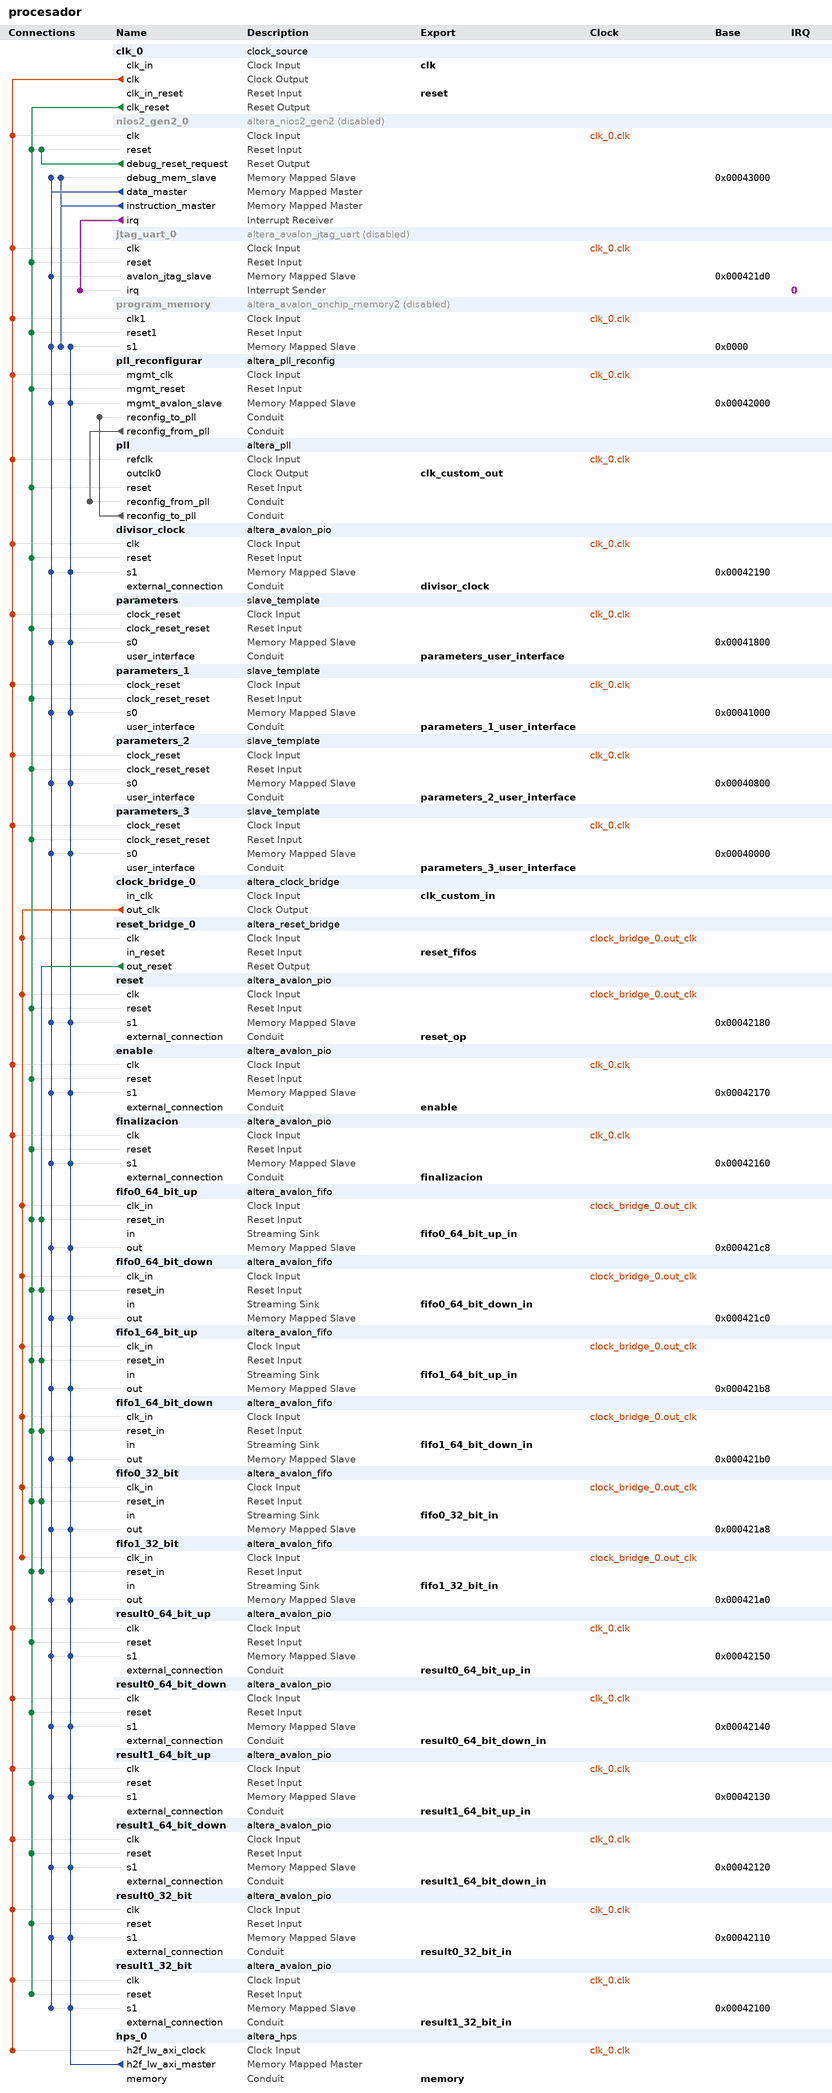
[diagram p0: system contents]
# Platform Designer (Qsys) system procesador, Cyclone V 5CSEMA5F31C6
# Parameters at their usual value, and those the tool derives, are not listed.
package require -exact qsys 17.1
create_system procesador
set_project_property DEVICE_FAMILY {Cyclone V}
set_project_property DEVICE 5CSEMA5F31C6

add_instance clk_0 clock_source 17.1
set_instance_parameter_value clk_0 clockFrequency 50000000

add_instance nios2_gen2_0 altera_nios2_gen2 17.1
set_instance_property nios2_gen2_0 ENABLED false
set_instance_parameter_value nios2_gen2_0 dcache_size 2048
set_instance_parameter_value nios2_gen2_0 exceptionSlave program_memory.s1
set_instance_parameter_value nios2_gen2_0 icache_size 4096
set_instance_parameter_value nios2_gen2_0 impl Tiny
set_instance_parameter_value nios2_gen2_0 resetSlave program_memory.s1

add_instance jtag_uart_0 altera_avalon_jtag_uart 17.1
set_instance_property jtag_uart_0 ENABLED false
set_instance_parameter_value jtag_uart_0 simInteractiveOptions NO_INTERACTIVE_WINDOWS

add_instance program_memory altera_avalon_onchip_memory2 17.1
set_instance_property program_memory ENABLED false
set_instance_parameter_value program_memory dataWidth 32
set_instance_parameter_value program_memory dualPort false
set_instance_parameter_value program_memory initMemContent true
set_instance_parameter_value program_memory initializationFileName onchip_mem.hex
set_instance_parameter_value program_memory memorySize 150000

add_instance pll_reconfigurar altera_pll_reconfig 17.1

add_instance pll altera_pll 17.1
set_instance_parameter_value pll gui_device_speed_grade 2
set_instance_parameter_value pll gui_en_adv_params true
set_instance_parameter_value pll gui_en_reconf true
set_instance_parameter_value pll gui_number_of_clocks 1
set_instance_parameter_value pll gui_operation_mode direct
set_instance_parameter_value pll gui_output_clock_frequency0 65.0
set_instance_parameter_value pll gui_pll_mode {Integer-N PLL}
set_instance_parameter_value pll gui_reference_clock_frequency 50.0
set_instance_parameter_value pll gui_use_locked false

add_instance divisor_clock altera_avalon_pio 17.1
set_instance_parameter_value divisor_clock direction Output
set_instance_parameter_value divisor_clock width 32

add_instance parameters slave_template 2.0
set_instance_parameter_value parameters DATA_WIDTH 32
set_instance_parameter_value parameters ENABLE_SYNC_SIGNALS 0
set_instance_parameter_value parameters IRQ_EN 0
set_instance_parameter_value parameters MODE_0 0
set_instance_parameter_value parameters MODE_1 0
set_instance_parameter_value parameters MODE_10 1
set_instance_parameter_value parameters MODE_11 1
set_instance_parameter_value parameters MODE_12 1
set_instance_parameter_value parameters MODE_13 1
set_instance_parameter_value parameters MODE_14 1
set_instance_parameter_value parameters MODE_15 1
set_instance_parameter_value parameters MODE_2 0
set_instance_parameter_value parameters MODE_3 0
set_instance_parameter_value parameters MODE_4 0
set_instance_parameter_value parameters MODE_5 0
set_instance_parameter_value parameters MODE_6 0
set_instance_parameter_value parameters MODE_7 0
set_instance_parameter_value parameters MODE_8 0
set_instance_parameter_value parameters MODE_9 0

add_instance parameters_1 slave_template 2.0
set_instance_parameter_value parameters_1 DATA_WIDTH 32
set_instance_parameter_value parameters_1 ENABLE_SYNC_SIGNALS 0
set_instance_parameter_value parameters_1 IRQ_EN 0
set_instance_parameter_value parameters_1 MODE_0 0
set_instance_parameter_value parameters_1 MODE_1 0
set_instance_parameter_value parameters_1 MODE_10 1
set_instance_parameter_value parameters_1 MODE_11 1
set_instance_parameter_value parameters_1 MODE_12 1
set_instance_parameter_value parameters_1 MODE_13 1
set_instance_parameter_value parameters_1 MODE_14 1
set_instance_parameter_value parameters_1 MODE_15 1
set_instance_parameter_value parameters_1 MODE_2 0
set_instance_parameter_value parameters_1 MODE_3 0
set_instance_parameter_value parameters_1 MODE_4 0
set_instance_parameter_value parameters_1 MODE_5 0
set_instance_parameter_value parameters_1 MODE_6 0
set_instance_parameter_value parameters_1 MODE_7 0
set_instance_parameter_value parameters_1 MODE_8 0
set_instance_parameter_value parameters_1 MODE_9 0

add_instance parameters_2 slave_template 2.0
set_instance_parameter_value parameters_2 DATA_WIDTH 32
set_instance_parameter_value parameters_2 ENABLE_SYNC_SIGNALS 0
set_instance_parameter_value parameters_2 IRQ_EN 0
set_instance_parameter_value parameters_2 MODE_0 0
set_instance_parameter_value parameters_2 MODE_1 0
set_instance_parameter_value parameters_2 MODE_10 1
set_instance_parameter_value parameters_2 MODE_11 1
set_instance_parameter_value parameters_2 MODE_12 1
set_instance_parameter_value parameters_2 MODE_13 1
set_instance_parameter_value parameters_2 MODE_14 1
set_instance_parameter_value parameters_2 MODE_15 1
set_instance_parameter_value parameters_2 MODE_2 0
set_instance_parameter_value parameters_2 MODE_3 0
set_instance_parameter_value parameters_2 MODE_4 0
set_instance_parameter_value parameters_2 MODE_5 0
set_instance_parameter_value parameters_2 MODE_6 0
set_instance_parameter_value parameters_2 MODE_7 0
set_instance_parameter_value parameters_2 MODE_8 0
set_instance_parameter_value parameters_2 MODE_9 0

add_instance parameters_3 slave_template 2.0
set_instance_parameter_value parameters_3 DATA_WIDTH 32
set_instance_parameter_value parameters_3 ENABLE_SYNC_SIGNALS 0
set_instance_parameter_value parameters_3 IRQ_EN 0
set_instance_parameter_value parameters_3 MODE_0 0
set_instance_parameter_value parameters_3 MODE_1 0
set_instance_parameter_value parameters_3 MODE_10 1
set_instance_parameter_value parameters_3 MODE_11 1
set_instance_parameter_value parameters_3 MODE_12 1
set_instance_parameter_value parameters_3 MODE_13 1
set_instance_parameter_value parameters_3 MODE_14 1
set_instance_parameter_value parameters_3 MODE_15 1
set_instance_parameter_value parameters_3 MODE_2 0
set_instance_parameter_value parameters_3 MODE_3 0
set_instance_parameter_value parameters_3 MODE_4 0
set_instance_parameter_value parameters_3 MODE_5 0
set_instance_parameter_value parameters_3 MODE_6 0
set_instance_parameter_value parameters_3 MODE_7 0
set_instance_parameter_value parameters_3 MODE_8 0
set_instance_parameter_value parameters_3 MODE_9 0

add_instance clock_bridge_0 altera_clock_bridge 17.1
set_instance_parameter_value clock_bridge_0 DERIVED_CLOCK_RATE 0
set_instance_parameter_value clock_bridge_0 EXPLICIT_CLOCK_RATE 0

add_instance reset_bridge_0 altera_reset_bridge 17.1
set_instance_parameter_value reset_bridge_0 ACTIVE_LOW_RESET 0
set_instance_parameter_value reset_bridge_0 SYNCHRONOUS_EDGES deassert

add_instance reset altera_avalon_pio 17.1
set_instance_parameter_value reset direction Output
set_instance_parameter_value reset width 1

add_instance enable altera_avalon_pio 17.1
set_instance_parameter_value enable direction Output
set_instance_parameter_value enable width 1

add_instance finalizacion altera_avalon_pio 17.1
set_instance_parameter_value finalizacion direction Input
set_instance_parameter_value finalizacion width 1

add_instance fifo0_64_bit_up altera_avalon_fifo 17.1
set_instance_parameter_value fifo0_64_bit_up bitsPerSymbol 32
set_instance_parameter_value fifo0_64_bit_up channelWidth 0
set_instance_parameter_value fifo0_64_bit_up errorWidth 0
set_instance_parameter_value fifo0_64_bit_up fifoDepth 16
set_instance_parameter_value fifo0_64_bit_up fifoInputInterfaceOptions AVALONST_SINK
set_instance_parameter_value fifo0_64_bit_up fifoOutputInterfaceOptions AVALONMM_READ
set_instance_parameter_value fifo0_64_bit_up singleClockMode true
set_instance_parameter_value fifo0_64_bit_up symbolsPerBeat 1
set_instance_parameter_value fifo0_64_bit_up useIRQ true
set_instance_parameter_value fifo0_64_bit_up usePacket false
set_instance_parameter_value fifo0_64_bit_up useReadControl false
set_instance_parameter_value fifo0_64_bit_up useWriteControl false

add_instance fifo0_64_bit_down altera_avalon_fifo 17.1
set_instance_parameter_value fifo0_64_bit_down bitsPerSymbol 32
set_instance_parameter_value fifo0_64_bit_down channelWidth 0
set_instance_parameter_value fifo0_64_bit_down errorWidth 0
set_instance_parameter_value fifo0_64_bit_down fifoDepth 16
set_instance_parameter_value fifo0_64_bit_down fifoInputInterfaceOptions AVALONST_SINK
set_instance_parameter_value fifo0_64_bit_down fifoOutputInterfaceOptions AVALONMM_READ
set_instance_parameter_value fifo0_64_bit_down singleClockMode true
set_instance_parameter_value fifo0_64_bit_down symbolsPerBeat 1
set_instance_parameter_value fifo0_64_bit_down useIRQ true
set_instance_parameter_value fifo0_64_bit_down usePacket false
set_instance_parameter_value fifo0_64_bit_down useReadControl false
set_instance_parameter_value fifo0_64_bit_down useWriteControl false

add_instance fifo1_64_bit_up altera_avalon_fifo 17.1
set_instance_parameter_value fifo1_64_bit_up bitsPerSymbol 32
set_instance_parameter_value fifo1_64_bit_up channelWidth 0
set_instance_parameter_value fifo1_64_bit_up errorWidth 0
set_instance_parameter_value fifo1_64_bit_up fifoDepth 16
set_instance_parameter_value fifo1_64_bit_up fifoInputInterfaceOptions AVALONST_SINK
set_instance_parameter_value fifo1_64_bit_up fifoOutputInterfaceOptions AVALONMM_READ
set_instance_parameter_value fifo1_64_bit_up singleClockMode true
set_instance_parameter_value fifo1_64_bit_up symbolsPerBeat 1
set_instance_parameter_value fifo1_64_bit_up useIRQ true
set_instance_parameter_value fifo1_64_bit_up usePacket false
set_instance_parameter_value fifo1_64_bit_up useReadControl false
set_instance_parameter_value fifo1_64_bit_up useWriteControl false

add_instance fifo1_64_bit_down altera_avalon_fifo 17.1
set_instance_parameter_value fifo1_64_bit_down bitsPerSymbol 32
set_instance_parameter_value fifo1_64_bit_down channelWidth 0
set_instance_parameter_value fifo1_64_bit_down errorWidth 0
set_instance_parameter_value fifo1_64_bit_down fifoDepth 16
set_instance_parameter_value fifo1_64_bit_down fifoInputInterfaceOptions AVALONST_SINK
set_instance_parameter_value fifo1_64_bit_down fifoOutputInterfaceOptions AVALONMM_READ
set_instance_parameter_value fifo1_64_bit_down singleClockMode true
set_instance_parameter_value fifo1_64_bit_down symbolsPerBeat 1
set_instance_parameter_value fifo1_64_bit_down useIRQ true
set_instance_parameter_value fifo1_64_bit_down usePacket false
set_instance_parameter_value fifo1_64_bit_down useReadControl false
set_instance_parameter_value fifo1_64_bit_down useWriteControl false

add_instance fifo0_32_bit altera_avalon_fifo 17.1
set_instance_parameter_value fifo0_32_bit bitsPerSymbol 32
set_instance_parameter_value fifo0_32_bit channelWidth 0
set_instance_parameter_value fifo0_32_bit errorWidth 0
set_instance_parameter_value fifo0_32_bit fifoDepth 8192
set_instance_parameter_value fifo0_32_bit fifoInputInterfaceOptions AVALONST_SINK
set_instance_parameter_value fifo0_32_bit fifoOutputInterfaceOptions AVALONMM_READ
set_instance_parameter_value fifo0_32_bit singleClockMode true
set_instance_parameter_value fifo0_32_bit symbolsPerBeat 1
set_instance_parameter_value fifo0_32_bit useIRQ true
set_instance_parameter_value fifo0_32_bit usePacket false
set_instance_parameter_value fifo0_32_bit useReadControl false
set_instance_parameter_value fifo0_32_bit useWriteControl false

add_instance fifo1_32_bit altera_avalon_fifo 17.1
set_instance_parameter_value fifo1_32_bit bitsPerSymbol 32
set_instance_parameter_value fifo1_32_bit channelWidth 0
set_instance_parameter_value fifo1_32_bit errorWidth 0
set_instance_parameter_value fifo1_32_bit fifoDepth 8192
set_instance_parameter_value fifo1_32_bit fifoInputInterfaceOptions AVALONST_SINK
set_instance_parameter_value fifo1_32_bit fifoOutputInterfaceOptions AVALONMM_READ
set_instance_parameter_value fifo1_32_bit singleClockMode true
set_instance_parameter_value fifo1_32_bit symbolsPerBeat 1
set_instance_parameter_value fifo1_32_bit useIRQ true
set_instance_parameter_value fifo1_32_bit usePacket false
set_instance_parameter_value fifo1_32_bit useReadControl false
set_instance_parameter_value fifo1_32_bit useWriteControl false

add_instance result0_64_bit_up altera_avalon_pio 17.1
set_instance_parameter_value result0_64_bit_up direction Input
set_instance_parameter_value result0_64_bit_up width 32

add_instance result0_64_bit_down altera_avalon_pio 17.1
set_instance_parameter_value result0_64_bit_down direction Input
set_instance_parameter_value result0_64_bit_down width 32

add_instance result1_64_bit_up altera_avalon_pio 17.1
set_instance_parameter_value result1_64_bit_up direction Input
set_instance_parameter_value result1_64_bit_up width 32

add_instance result1_64_bit_down altera_avalon_pio 17.1
set_instance_parameter_value result1_64_bit_down direction Input
set_instance_parameter_value result1_64_bit_down width 32

add_instance result0_32_bit altera_avalon_pio 17.1
set_instance_parameter_value result0_32_bit direction Input
set_instance_parameter_value result0_32_bit width 32

add_instance result1_32_bit altera_avalon_pio 17.1
set_instance_parameter_value result1_32_bit direction Input
set_instance_parameter_value result1_32_bit width 32

add_instance hps_0 altera_hps 17.1
set_instance_parameter_value hps_0 EMAC1_Mode N/A
set_instance_parameter_value hps_0 EMAC1_PinMuxing Unused
set_instance_parameter_value hps_0 F2SCLK_COLDRST_Enable false
set_instance_parameter_value hps_0 F2SCLK_DBGRST_Enable false
set_instance_parameter_value hps_0 F2SCLK_WARMRST_Enable false
set_instance_parameter_value hps_0 F2SINTERRUPT_Enable false
set_instance_parameter_value hps_0 F2S_Width 0
set_instance_parameter_value hps_0 FPGA_PERIPHERAL_OUTPUT_CLOCK_FREQ_EMAC0_GTX_CLK 125
set_instance_parameter_value hps_0 FPGA_PERIPHERAL_OUTPUT_CLOCK_FREQ_EMAC0_MD_CLK 2.5
set_instance_parameter_value hps_0 FPGA_PERIPHERAL_OUTPUT_CLOCK_FREQ_EMAC1_GTX_CLK 125
set_instance_parameter_value hps_0 FPGA_PERIPHERAL_OUTPUT_CLOCK_FREQ_EMAC1_MD_CLK 2.5
set_instance_parameter_value hps_0 HPS_PROTOCOL DDR3
set_instance_parameter_value hps_0 I2C0_Mode N/A
set_instance_parameter_value hps_0 I2C0_PinMuxing Unused
set_instance_parameter_value hps_0 I2C1_Mode N/A
set_instance_parameter_value hps_0 I2C1_PinMuxing Unused
set_instance_parameter_value hps_0 LWH2F_Enable true
set_instance_parameter_value hps_0 MEM_BANKADDR_WIDTH 3
set_instance_parameter_value hps_0 MEM_CLK_FREQ 300.0
set_instance_parameter_value hps_0 MEM_CLK_FREQ_MAX 400.0
set_instance_parameter_value hps_0 MEM_COL_ADDR_WIDTH 8
set_instance_parameter_value hps_0 MEM_DQ_WIDTH 8
set_instance_parameter_value hps_0 MEM_DRV_STR RZQ/6
set_instance_parameter_value hps_0 MEM_ROW_ADDR_WIDTH 12
set_instance_parameter_value hps_0 MEM_RTT_NOM {ODT Disabled}
set_instance_parameter_value hps_0 MEM_RTT_WR {Dynamic ODT off}
set_instance_parameter_value hps_0 MEM_TCL 7
set_instance_parameter_value hps_0 MEM_TFAW_NS 37.5
set_instance_parameter_value hps_0 MEM_TINIT_US 499
set_instance_parameter_value hps_0 MEM_TMRD_CK 3
set_instance_parameter_value hps_0 MEM_TRAS_NS 40.0
set_instance_parameter_value hps_0 MEM_TRCD_NS 15.0
set_instance_parameter_value hps_0 MEM_TREFI_US 7.0
set_instance_parameter_value hps_0 MEM_TRFC_NS 75.0
set_instance_parameter_value hps_0 MEM_TRP_NS 15.0
set_instance_parameter_value hps_0 MEM_TWTR 2
set_instance_parameter_value hps_0 MEM_VENDOR JEDEC
set_instance_parameter_value hps_0 MEM_WTCL 6
set_instance_parameter_value hps_0 QSPI_Mode N/A
set_instance_parameter_value hps_0 QSPI_PinMuxing Unused
set_instance_parameter_value hps_0 REF_CLK_FREQ 125.0
set_instance_parameter_value hps_0 S2FCLK_USER2CLK 5
set_instance_parameter_value hps_0 S2F_Width 0
set_instance_parameter_value hps_0 SDIO_Mode N/A
set_instance_parameter_value hps_0 SDIO_PinMuxing Unused
set_instance_parameter_value hps_0 SPIM1_Mode N/A
set_instance_parameter_value hps_0 SPIM1_PinMuxing Unused
set_instance_parameter_value hps_0 STM_Enable false
set_instance_parameter_value hps_0 TIMING_BOARD_AC_SKEW 0.02
set_instance_parameter_value hps_0 TIMING_BOARD_AC_TO_CK_SKEW 0.0
set_instance_parameter_value hps_0 TIMING_BOARD_DQ_TO_DQS_SKEW 0.0
set_instance_parameter_value hps_0 TIMING_BOARD_MAX_CK_DELAY 0.6
set_instance_parameter_value hps_0 TIMING_BOARD_MAX_DQS_DELAY 0.6
set_instance_parameter_value hps_0 TIMING_BOARD_SKEW_BETWEEN_DQS 0.02
set_instance_parameter_value hps_0 TIMING_BOARD_SKEW_CKDQS_DIMM_MAX 0.01
set_instance_parameter_value hps_0 TIMING_BOARD_SKEW_CKDQS_DIMM_MIN -0.01
set_instance_parameter_value hps_0 TIMING_BOARD_SKEW_WITHIN_DQS 0.02
set_instance_parameter_value hps_0 TIMING_TDH 125
set_instance_parameter_value hps_0 TIMING_TDQSCK 400
set_instance_parameter_value hps_0 TIMING_TDQSQ 120
set_instance_parameter_value hps_0 TIMING_TDS 50
set_instance_parameter_value hps_0 TIMING_TIH 250
set_instance_parameter_value hps_0 TIMING_TIS 175
set_instance_parameter_value hps_0 TIMING_TQSH 0.38
set_instance_parameter_value hps_0 UART0_Mode N/A
set_instance_parameter_value hps_0 UART0_PinMuxing Unused
set_instance_parameter_value hps_0 USB1_Mode N/A
set_instance_parameter_value hps_0 USB1_PinMuxing Unused
set_instance_parameter_value hps_0 desired_cfg_clk_mhz 100.0
set_instance_parameter_value hps_0 desired_qspi_clk_mhz 400.0

# connections
add_connection clk_0.clk divisor_clock.clk clock
add_connection clk_0.clk enable.clk clock
add_connection clk_0.clk finalizacion.clk clock
add_connection clk_0.clk hps_0.h2f_lw_axi_clock clock
add_connection clk_0.clk jtag_uart_0.clk clock
add_connection clk_0.clk nios2_gen2_0.clk clock
add_connection clk_0.clk parameters.clock_reset clock
add_connection clk_0.clk parameters_1.clock_reset clock
add_connection clk_0.clk parameters_2.clock_reset clock
add_connection clk_0.clk parameters_3.clock_reset clock
add_connection clk_0.clk pll.refclk clock
add_connection clk_0.clk pll_reconfigurar.mgmt_clk clock
add_connection clk_0.clk program_memory.clk1 clock
add_connection clk_0.clk result0_32_bit.clk clock
add_connection clk_0.clk result0_64_bit_down.clk clock
add_connection clk_0.clk result0_64_bit_up.clk clock
add_connection clk_0.clk result1_32_bit.clk clock
add_connection clk_0.clk result1_64_bit_down.clk clock
add_connection clk_0.clk result1_64_bit_up.clk clock
add_connection clock_bridge_0.out_clk fifo0_32_bit.clk_in clock
add_connection clock_bridge_0.out_clk fifo0_64_bit_down.clk_in clock
add_connection clock_bridge_0.out_clk fifo0_64_bit_up.clk_in clock
add_connection clock_bridge_0.out_clk fifo1_32_bit.clk_in clock
add_connection clock_bridge_0.out_clk fifo1_64_bit_down.clk_in clock
add_connection clock_bridge_0.out_clk fifo1_64_bit_up.clk_in clock
add_connection clock_bridge_0.out_clk reset.clk clock
add_connection clock_bridge_0.out_clk reset_bridge_0.clk clock
add_connection clk_0.clk_reset divisor_clock.reset reset
add_connection clk_0.clk_reset enable.reset reset
add_connection clk_0.clk_reset fifo0_32_bit.reset_in reset
add_connection clk_0.clk_reset fifo0_64_bit_down.reset_in reset
add_connection clk_0.clk_reset fifo0_64_bit_up.reset_in reset
add_connection clk_0.clk_reset fifo1_32_bit.reset_in reset
add_connection clk_0.clk_reset fifo1_64_bit_down.reset_in reset
add_connection clk_0.clk_reset fifo1_64_bit_up.reset_in reset
add_connection clk_0.clk_reset finalizacion.reset reset
add_connection clk_0.clk_reset jtag_uart_0.reset reset
add_connection clk_0.clk_reset nios2_gen2_0.reset reset
add_connection clk_0.clk_reset parameters.clock_reset_reset reset
add_connection clk_0.clk_reset parameters_1.clock_reset_reset reset
add_connection clk_0.clk_reset parameters_2.clock_reset_reset reset
add_connection clk_0.clk_reset parameters_3.clock_reset_reset reset
add_connection clk_0.clk_reset pll.reset reset
add_connection clk_0.clk_reset pll_reconfigurar.mgmt_reset reset
add_connection clk_0.clk_reset program_memory.reset1 reset
add_connection clk_0.clk_reset reset.reset reset
add_connection clk_0.clk_reset result0_32_bit.reset reset
add_connection clk_0.clk_reset result0_64_bit_down.reset reset
add_connection clk_0.clk_reset result0_64_bit_up.reset reset
add_connection clk_0.clk_reset result1_32_bit.reset reset
add_connection clk_0.clk_reset result1_64_bit_down.reset reset
add_connection clk_0.clk_reset result1_64_bit_up.reset reset
add_connection nios2_gen2_0.debug_reset_request nios2_gen2_0.reset reset
add_connection reset_bridge_0.out_reset fifo0_32_bit.reset_in reset
add_connection reset_bridge_0.out_reset fifo0_64_bit_down.reset_in reset
add_connection reset_bridge_0.out_reset fifo0_64_bit_up.reset_in reset
add_connection reset_bridge_0.out_reset fifo1_32_bit.reset_in reset
add_connection reset_bridge_0.out_reset fifo1_64_bit_down.reset_in reset
add_connection reset_bridge_0.out_reset fifo1_64_bit_up.reset_in reset
add_connection hps_0.h2f_lw_axi_master divisor_clock.s1 avalon
set_connection_parameter_value hps_0.h2f_lw_axi_master/divisor_clock.s1 baseAddress 0x00042190
add_connection hps_0.h2f_lw_axi_master enable.s1 avalon
set_connection_parameter_value hps_0.h2f_lw_axi_master/enable.s1 baseAddress 0x00042170
add_connection hps_0.h2f_lw_axi_master fifo0_32_bit.out avalon
set_connection_parameter_value hps_0.h2f_lw_axi_master/fifo0_32_bit.out baseAddress 0x000421a8
add_connection hps_0.h2f_lw_axi_master fifo0_64_bit_down.out avalon
set_connection_parameter_value hps_0.h2f_lw_axi_master/fifo0_64_bit_down.out baseAddress 0x000421c0
add_connection hps_0.h2f_lw_axi_master fifo0_64_bit_up.out avalon
set_connection_parameter_value hps_0.h2f_lw_axi_master/fifo0_64_bit_up.out baseAddress 0x000421c8
add_connection hps_0.h2f_lw_axi_master fifo1_32_bit.out avalon
set_connection_parameter_value hps_0.h2f_lw_axi_master/fifo1_32_bit.out baseAddress 0x000421a0
add_connection hps_0.h2f_lw_axi_master fifo1_64_bit_down.out avalon
set_connection_parameter_value hps_0.h2f_lw_axi_master/fifo1_64_bit_down.out baseAddress 0x000421b0
add_connection hps_0.h2f_lw_axi_master fifo1_64_bit_up.out avalon
set_connection_parameter_value hps_0.h2f_lw_axi_master/fifo1_64_bit_up.out baseAddress 0x000421b8
add_connection hps_0.h2f_lw_axi_master finalizacion.s1 avalon
set_connection_parameter_value hps_0.h2f_lw_axi_master/finalizacion.s1 baseAddress 0x00042160
add_connection hps_0.h2f_lw_axi_master parameters.s0 avalon
set_connection_parameter_value hps_0.h2f_lw_axi_master/parameters.s0 baseAddress 0x00041800
add_connection hps_0.h2f_lw_axi_master parameters_1.s0 avalon
set_connection_parameter_value hps_0.h2f_lw_axi_master/parameters_1.s0 baseAddress 0x00041000
add_connection hps_0.h2f_lw_axi_master parameters_2.s0 avalon
set_connection_parameter_value hps_0.h2f_lw_axi_master/parameters_2.s0 baseAddress 0x00040800
add_connection hps_0.h2f_lw_axi_master parameters_3.s0 avalon
set_connection_parameter_value hps_0.h2f_lw_axi_master/parameters_3.s0 baseAddress 0x00040000
add_connection hps_0.h2f_lw_axi_master pll_reconfigurar.mgmt_avalon_slave avalon
set_connection_parameter_value hps_0.h2f_lw_axi_master/pll_reconfigurar.mgmt_avalon_slave baseAddress 0x00042000
add_connection hps_0.h2f_lw_axi_master program_memory.s1 avalon
set_connection_parameter_value hps_0.h2f_lw_axi_master/program_memory.s1 baseAddress 0x0000
add_connection hps_0.h2f_lw_axi_master reset.s1 avalon
set_connection_parameter_value hps_0.h2f_lw_axi_master/reset.s1 baseAddress 0x00042180
add_connection hps_0.h2f_lw_axi_master result0_32_bit.s1 avalon
set_connection_parameter_value hps_0.h2f_lw_axi_master/result0_32_bit.s1 baseAddress 0x00042110
add_connection hps_0.h2f_lw_axi_master result0_64_bit_down.s1 avalon
set_connection_parameter_value hps_0.h2f_lw_axi_master/result0_64_bit_down.s1 baseAddress 0x00042140
add_connection hps_0.h2f_lw_axi_master result0_64_bit_up.s1 avalon
set_connection_parameter_value hps_0.h2f_lw_axi_master/result0_64_bit_up.s1 baseAddress 0x00042150
add_connection hps_0.h2f_lw_axi_master result1_32_bit.s1 avalon
set_connection_parameter_value hps_0.h2f_lw_axi_master/result1_32_bit.s1 baseAddress 0x00042100
add_connection hps_0.h2f_lw_axi_master result1_64_bit_down.s1 avalon
set_connection_parameter_value hps_0.h2f_lw_axi_master/result1_64_bit_down.s1 baseAddress 0x00042120
add_connection hps_0.h2f_lw_axi_master result1_64_bit_up.s1 avalon
set_connection_parameter_value hps_0.h2f_lw_axi_master/result1_64_bit_up.s1 baseAddress 0x00042130
add_connection nios2_gen2_0.data_master divisor_clock.s1 avalon
set_connection_parameter_value nios2_gen2_0.data_master/divisor_clock.s1 baseAddress 0x00042190
add_connection nios2_gen2_0.data_master enable.s1 avalon
set_connection_parameter_value nios2_gen2_0.data_master/enable.s1 baseAddress 0x00042170
add_connection nios2_gen2_0.data_master fifo0_32_bit.out avalon
set_connection_parameter_value nios2_gen2_0.data_master/fifo0_32_bit.out baseAddress 0x000421a8
add_connection nios2_gen2_0.data_master fifo0_64_bit_down.out avalon
set_connection_parameter_value nios2_gen2_0.data_master/fifo0_64_bit_down.out baseAddress 0x000421c0
add_connection nios2_gen2_0.data_master fifo0_64_bit_up.out avalon
set_connection_parameter_value nios2_gen2_0.data_master/fifo0_64_bit_up.out baseAddress 0x000421c8
add_connection nios2_gen2_0.data_master fifo1_32_bit.out avalon
set_connection_parameter_value nios2_gen2_0.data_master/fifo1_32_bit.out baseAddress 0x000421a0
add_connection nios2_gen2_0.data_master fifo1_64_bit_down.out avalon
set_connection_parameter_value nios2_gen2_0.data_master/fifo1_64_bit_down.out baseAddress 0x000421b0
add_connection nios2_gen2_0.data_master fifo1_64_bit_up.out avalon
set_connection_parameter_value nios2_gen2_0.data_master/fifo1_64_bit_up.out baseAddress 0x000421b8
add_connection nios2_gen2_0.data_master finalizacion.s1 avalon
set_connection_parameter_value nios2_gen2_0.data_master/finalizacion.s1 baseAddress 0x00042160
add_connection nios2_gen2_0.data_master jtag_uart_0.avalon_jtag_slave avalon
set_connection_parameter_value nios2_gen2_0.data_master/jtag_uart_0.avalon_jtag_slave baseAddress 0x000421d0
add_connection nios2_gen2_0.data_master nios2_gen2_0.debug_mem_slave avalon
set_connection_parameter_value nios2_gen2_0.data_master/nios2_gen2_0.debug_mem_slave baseAddress 0x00043000
add_connection nios2_gen2_0.data_master parameters.s0 avalon
set_connection_parameter_value nios2_gen2_0.data_master/parameters.s0 baseAddress 0x00041800
add_connection nios2_gen2_0.data_master parameters_1.s0 avalon
set_connection_parameter_value nios2_gen2_0.data_master/parameters_1.s0 baseAddress 0x00041000
add_connection nios2_gen2_0.data_master parameters_2.s0 avalon
set_connection_parameter_value nios2_gen2_0.data_master/parameters_2.s0 baseAddress 0x00040800
add_connection nios2_gen2_0.data_master parameters_3.s0 avalon
set_connection_parameter_value nios2_gen2_0.data_master/parameters_3.s0 baseAddress 0x00040000
add_connection nios2_gen2_0.data_master pll_reconfigurar.mgmt_avalon_slave avalon
set_connection_parameter_value nios2_gen2_0.data_master/pll_reconfigurar.mgmt_avalon_slave baseAddress 0x00042000
add_connection nios2_gen2_0.data_master program_memory.s1 avalon
set_connection_parameter_value nios2_gen2_0.data_master/program_memory.s1 baseAddress 0x0000
add_connection nios2_gen2_0.data_master reset.s1 avalon
set_connection_parameter_value nios2_gen2_0.data_master/reset.s1 baseAddress 0x00042180
add_connection nios2_gen2_0.data_master result0_32_bit.s1 avalon
set_connection_parameter_value nios2_gen2_0.data_master/result0_32_bit.s1 baseAddress 0x00042110
add_connection nios2_gen2_0.data_master result0_64_bit_down.s1 avalon
set_connection_parameter_value nios2_gen2_0.data_master/result0_64_bit_down.s1 baseAddress 0x00042140
add_connection nios2_gen2_0.data_master result0_64_bit_up.s1 avalon
set_connection_parameter_value nios2_gen2_0.data_master/result0_64_bit_up.s1 baseAddress 0x00042150
add_connection nios2_gen2_0.data_master result1_32_bit.s1 avalon
set_connection_parameter_value nios2_gen2_0.data_master/result1_32_bit.s1 baseAddress 0x00042100
add_connection nios2_gen2_0.data_master result1_64_bit_down.s1 avalon
set_connection_parameter_value nios2_gen2_0.data_master/result1_64_bit_down.s1 baseAddress 0x00042120
add_connection nios2_gen2_0.data_master result1_64_bit_up.s1 avalon
set_connection_parameter_value nios2_gen2_0.data_master/result1_64_bit_up.s1 baseAddress 0x00042130
add_connection nios2_gen2_0.instruction_master nios2_gen2_0.debug_mem_slave avalon
set_connection_parameter_value nios2_gen2_0.instruction_master/nios2_gen2_0.debug_mem_slave baseAddress 0x00043000
add_connection nios2_gen2_0.instruction_master program_memory.s1 avalon
set_connection_parameter_value nios2_gen2_0.instruction_master/program_memory.s1 baseAddress 0x0000
add_connection pll.reconfig_to_pll pll_reconfigurar.reconfig_to_pll conduit
add_connection pll_reconfigurar.reconfig_from_pll pll.reconfig_from_pll conduit
add_connection nios2_gen2_0.irq jtag_uart_0.irq interrupt
set_connection_parameter_value nios2_gen2_0.irq/jtag_uart_0.irq irqNumber 0

# exported interfaces
add_interface clk clock sink
set_interface_property clk EXPORT_OF clk_0.clk_in
add_interface clk_custom_in clock sink
set_interface_property clk_custom_in EXPORT_OF clock_bridge_0.in_clk
add_interface clk_custom_out clock source
set_interface_property clk_custom_out EXPORT_OF pll.outclk0
add_interface divisor_clock conduit end
set_interface_property divisor_clock EXPORT_OF divisor_clock.external_connection
add_interface enable conduit end
set_interface_property enable EXPORT_OF enable.external_connection
add_interface fifo0_32_bit_in avalon_streaming sink
set_interface_property fifo0_32_bit_in EXPORT_OF fifo0_32_bit.in
add_interface fifo0_64_bit_down_in avalon_streaming sink
set_interface_property fifo0_64_bit_down_in EXPORT_OF fifo0_64_bit_down.in
add_interface fifo0_64_bit_up_in avalon_streaming sink
set_interface_property fifo0_64_bit_up_in EXPORT_OF fifo0_64_bit_up.in
add_interface fifo1_32_bit_in avalon_streaming sink
set_interface_property fifo1_32_bit_in EXPORT_OF fifo1_32_bit.in
add_interface fifo1_64_bit_down_in avalon_streaming sink
set_interface_property fifo1_64_bit_down_in EXPORT_OF fifo1_64_bit_down.in
add_interface fifo1_64_bit_up_in avalon_streaming sink
set_interface_property fifo1_64_bit_up_in EXPORT_OF fifo1_64_bit_up.in
add_interface finalizacion conduit end
set_interface_property finalizacion EXPORT_OF finalizacion.external_connection
add_interface memory conduit end
set_interface_property memory EXPORT_OF hps_0.memory
add_interface parameters_1_user_interface conduit end
set_interface_property parameters_1_user_interface EXPORT_OF parameters_1.user_interface
add_interface parameters_2_user_interface conduit end
set_interface_property parameters_2_user_interface EXPORT_OF parameters_2.user_interface
add_interface parameters_3_user_interface conduit end
set_interface_property parameters_3_user_interface EXPORT_OF parameters_3.user_interface
add_interface parameters_user_interface conduit end
set_interface_property parameters_user_interface EXPORT_OF parameters.user_interface
add_interface reset reset sink
set_interface_property reset EXPORT_OF clk_0.clk_in_reset
add_interface reset_fifos reset sink
set_interface_property reset_fifos EXPORT_OF reset_bridge_0.in_reset
add_interface reset_op conduit end
set_interface_property reset_op EXPORT_OF reset.external_connection
add_interface result0_32_bit_in conduit end
set_interface_property result0_32_bit_in EXPORT_OF result0_32_bit.external_connection
add_interface result0_64_bit_down_in conduit end
set_interface_property result0_64_bit_down_in EXPORT_OF result0_64_bit_down.external_connection
add_interface result0_64_bit_up_in conduit end
set_interface_property result0_64_bit_up_in EXPORT_OF result0_64_bit_up.external_connection
add_interface result1_32_bit_in conduit end
set_interface_property result1_32_bit_in EXPORT_OF result1_32_bit.external_connection
add_interface result1_64_bit_down_in conduit end
set_interface_property result1_64_bit_down_in EXPORT_OF result1_64_bit_down.external_connection
add_interface result1_64_bit_up_in conduit end
set_interface_property result1_64_bit_up_in EXPORT_OF result1_64_bit_up.external_connection

set_interconnect_requirement {$system} qsys_mm.clockCrossingAdapter HANDSHAKE
set_interconnect_requirement {$system} qsys_mm.enableEccProtection FALSE
set_interconnect_requirement {$system} qsys_mm.insertDefaultSlave FALSE
set_interconnect_requirement {$system} qsys_mm.maxAdditionalLatency 1

save_system procesador.qsys
